# EAGLE schematic ArdShld_brd (v3~recovered) (EAGLE 9.7.0)
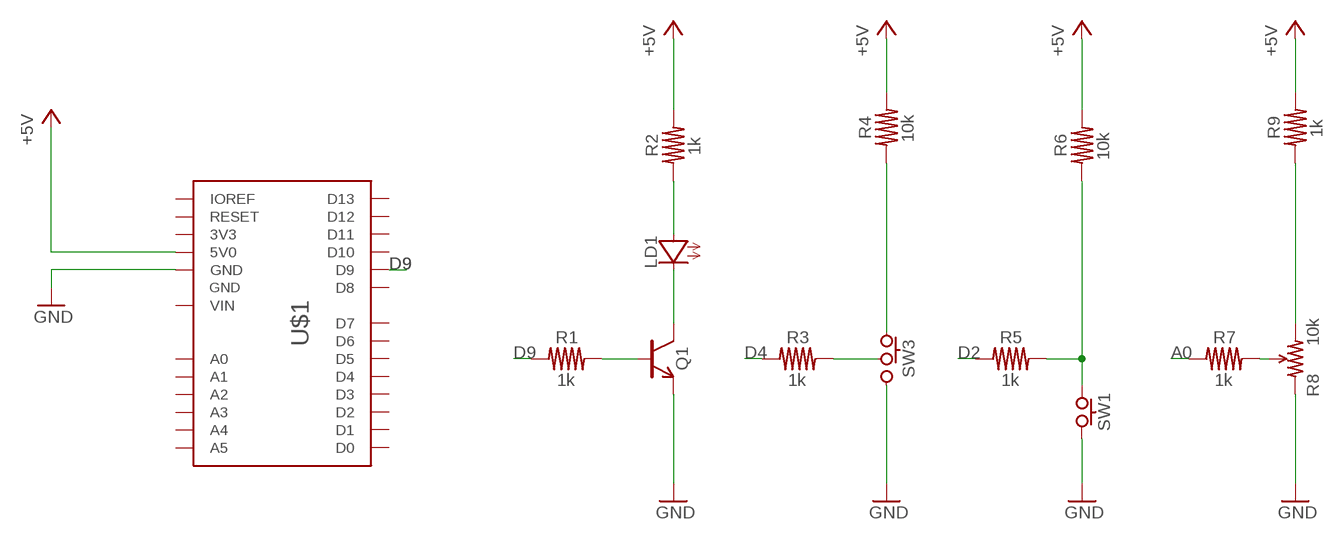
[diagram p0: schematic, sheet 1]

## Parts
LD1  LED  [LED100MIL]
Q1  TR-NPN  [TR300MIL]
R1  1k  RESISTOR  [R300MIL]
R2  1k  RESISTOR  [R300MIL]
R3  1k  RESISTOR  [R300MIL]
R4  10k  RESISTOR  [R300MIL]
R5  1k  RESISTOR  [R300MIL]
R6  10k  RESISTOR  [R300MIL]
R7  1k  RESISTOR  [R300MIL]
R8  10k  TRIM-R  [TRIM-R]
R9  1k  RESISTOR  [R300MIL]
SW1  PUSHSW  [PUSHSW]
SW3  SLIDESW  [SLIDESW]
U$1  ARDSHLD  [ARDSHLD]

## Nets
+5V: R2.P$2 R4.P$2 R6.P$2 R9.P$2 U$1.5V(5V0)
A0: R7.P$1
D2: R5.P$1
D4: R3.P$1
D9: R1.P$1 U$1.D9
GND: Q1.P$1(E) R8.P0 SW1.P$5 SW1.P$6 SW1.P$7 SW3.P$3 U$1.GND@1(GND) U$1.GND@2(GND)
N$1: LD1.K Q1.P$2(C)
N$2: LD1.A R2.P$1
N$3: Q1.P$3(B) R1.P$2
N$4: R5.P$2 R6.P$1 SW1.P$1 SW1.P$2 SW1.P$3 SW1.P$4
N$5: R4.P$1 SW3.P$1
N$6: R8.P1 R9.P$1
N$7: R3.P$2 SW3.P$2
N$11: R7.P$2 R8.P2
Unconnected: U$1.3V3 U$1.A0 U$1.A1 U$1.A2 U$1.A3 U$1.A4 U$1.A5 U$1.D0 U$1.D1 U$1.D2 U$1.D3 U$1.D4 U$1.D5 U$1.D6 U$1.D7 U$1.D8 U$1.D10 U$1.D11 U$1.D12 U$1.D13 U$1.IOREF U$1.RESET U$1.VIN

## Library data of the parts
LD1 = 1rizmlib:LED
Q1 = 1rizmlib:TR-NPN
R1-R7 R9 = 1rizmlib:RESISTOR
R8 = 1rizmlib:TRIM-R
SW1 = 1rizmlib:PUSHSW
SW3 = 1rizmlib:SLIDESW
U$1 = 1rizmlib:ARDSHLD